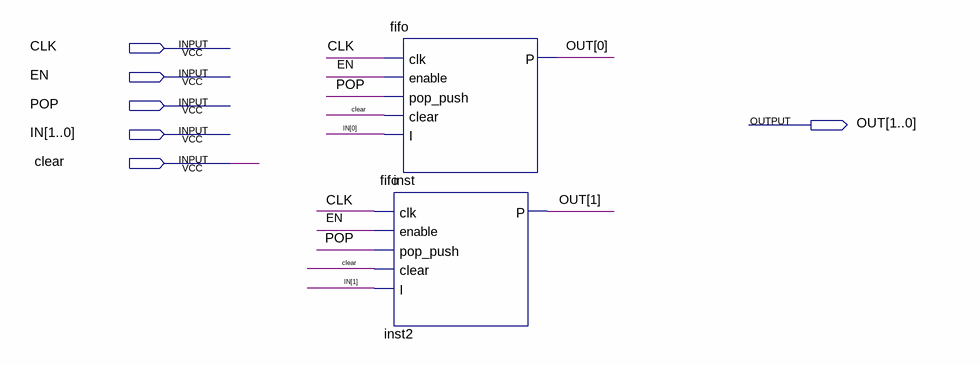
[diagram p0: schematic sheet]
// Quartus schematic branch_queue.bdf as structural Verilog: 2 symbols, 6 pins
module branch_queue (
  input  CLK,
  input  EN,
  input  POP,
  input  [1:0] IN,
  input  clear,
  output [1:0] OUT
);

  fifo inst (.clk(CLK), .enable(EN), .pop_push(POP), .clear(clear), .I(IN[0]), .P(OUT[0]));
  fifo inst2 (.clk(CLK), .enable(EN), .pop_push(POP), .clear(clear), .I(IN[1]), .P(OUT[1]));
endmodule
